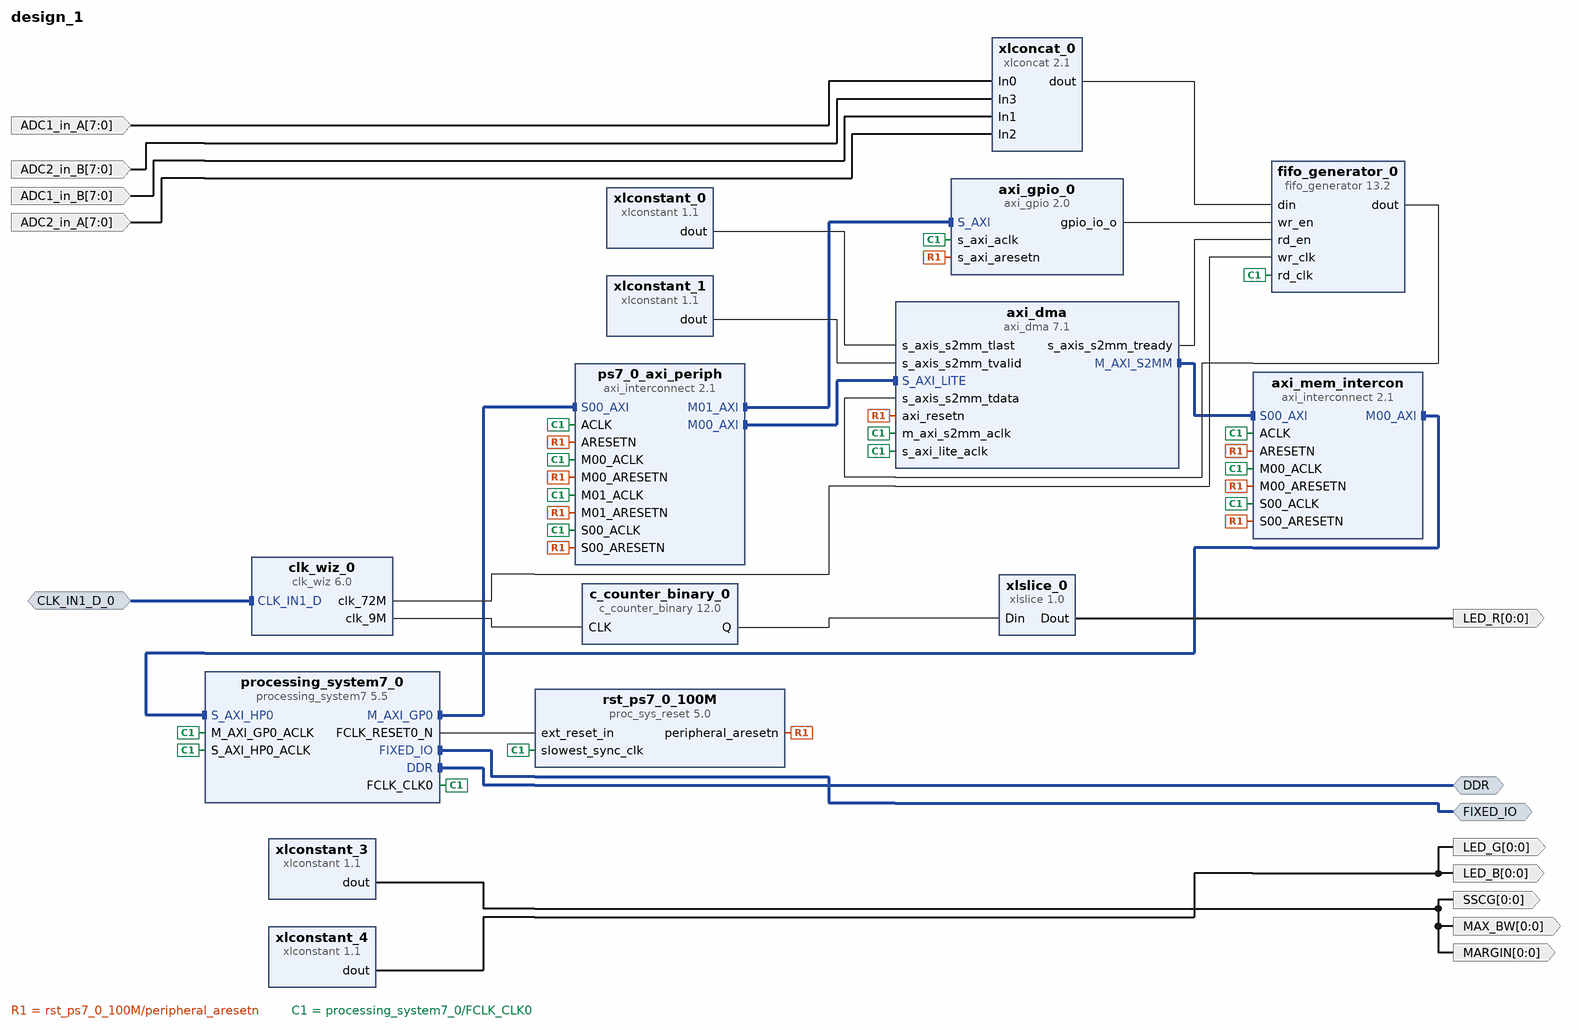
[diagram p0: block diagram of the top level]
# Vivado block design design_1, xc7z020clg400-1, Vivado 2020.1
create_bd_design design_1

create_bd_intf_port -mode Master -vlnv xilinx.com:interface:ddrx_rtl:1.0 DDR
create_bd_intf_port -mode Master -vlnv xilinx.com:display_processing_system7:fixedio_rtl:1.0 FIXED_IO
create_bd_intf_port -mode Slave -vlnv xilinx.com:interface:diff_clock_rtl:1.0 CLK_IN1_D_0
set_property -dict {CONFIG.FREQ_HZ 72000000} [get_bd_intf_ports CLK_IN1_D_0]
create_bd_port -dir I -from 7 -to 0 -type data ADC2_in_B
create_bd_port -dir I -from 7 -to 0 -type data ADC2_in_A
create_bd_port -dir I -from 7 -to 0 -type data ADC1_in_A
create_bd_port -dir I -from 7 -to 0 -type data ADC1_in_B
create_bd_port -dir O -from 0 -to 0 -type data LED_R
create_bd_port -dir O -from 0 -to 0 SSCG
create_bd_port -dir O -from 0 -to 0 MARGIN
create_bd_port -dir O -from 0 -to 0 MAX_BW
create_bd_port -dir O -from 0 -to 0 -type data LED_G
create_bd_port -dir O -from 0 -to 0 -type data LED_B

create_bd_cell -type ip -vlnv xilinx.com:ip:processing_system7:5.5 processing_system7_0
set_property -dict [list \
  CONFIG.PCW_APU_PERIPHERAL_FREQMHZ 666.666666 \
  CONFIG.PCW_CAN0_CAN0_IO {MIO 14 .. 15} \
  CONFIG.PCW_CAN0_PERIPHERAL_ENABLE 1 \
  CONFIG.PCW_ENET0_ENET0_IO {MIO 16 .. 27} \
  CONFIG.PCW_ENET0_GRP_MDIO_ENABLE 1 \
  CONFIG.PCW_ENET0_GRP_MDIO_IO {MIO 52 .. 53} \
  CONFIG.PCW_ENET0_PERIPHERAL_CLKSRC {ARM PLL} \
  CONFIG.PCW_ENET0_PERIPHERAL_ENABLE 1 \
  CONFIG.PCW_ENET_RESET_ENABLE 0 \
  CONFIG.PCW_FPGA0_PERIPHERAL_FREQMHZ 100 \
  CONFIG.PCW_FPGA1_PERIPHERAL_FREQMHZ 50 \
  CONFIG.PCW_GPIO_EMIO_GPIO_ENABLE 1 \
  CONFIG.PCW_GPIO_EMIO_GPIO_IO 1 \
  CONFIG.PCW_GPIO_EMIO_GPIO_WIDTH 1 \
  CONFIG.PCW_GPIO_MIO_GPIO_ENABLE 1 \
  CONFIG.PCW_GPIO_MIO_GPIO_IO MIO \
  CONFIG.PCW_GPIO_PERIPHERAL_ENABLE 1 \
  CONFIG.PCW_I2C0_I2C0_IO EMIO \
  CONFIG.PCW_I2C0_PERIPHERAL_ENABLE 1 \
  CONFIG.PCW_I2C1_I2C1_IO {MIO 12 .. 13} \
  CONFIG.PCW_I2C1_PERIPHERAL_ENABLE 1 \
  CONFIG.PCW_I2C_PERIPHERAL_FREQMHZ 83.333336 \
  CONFIG.PCW_I2C_RESET_ENABLE 0 \
  CONFIG.PCW_PRESET_BANK1_VOLTAGE {LVCMOS 1.8V} \
  CONFIG.PCW_QSPI_GRP_FBCLK_ENABLE 1 \
  CONFIG.PCW_QSPI_GRP_FBCLK_IO {MIO 8} \
  CONFIG.PCW_QSPI_GRP_SINGLE_SS_ENABLE 1 \
  CONFIG.PCW_QSPI_GRP_SINGLE_SS_IO {MIO 1 .. 6} \
  CONFIG.PCW_QSPI_PERIPHERAL_ENABLE 1 \
  CONFIG.PCW_QSPI_QSPI_IO {MIO 1 .. 6} \
  CONFIG.PCW_SD0_GRP_CD_ENABLE 1 \
  CONFIG.PCW_SD0_GRP_CD_IO {MIO 46} \
  CONFIG.PCW_SD0_GRP_WP_ENABLE 1 \
  CONFIG.PCW_SD0_GRP_WP_IO {MIO 47} \
  CONFIG.PCW_SD0_PERIPHERAL_ENABLE 1 \
  CONFIG.PCW_SD0_SD0_IO {MIO 40 .. 45} \
  CONFIG.PCW_SDIO_PERIPHERAL_FREQMHZ 100 \
  CONFIG.PCW_SINGLE_QSPI_DATA_MODE x4 \
  CONFIG.PCW_TTC0_PERIPHERAL_ENABLE 1 \
  CONFIG.PCW_TTC0_TTC0_IO EMIO \
  CONFIG.PCW_UART0_PERIPHERAL_ENABLE 1 \
  CONFIG.PCW_UART0_UART0_IO {MIO 10 .. 11} \
  CONFIG.PCW_UART1_PERIPHERAL_ENABLE 1 \
  CONFIG.PCW_UART1_UART1_IO {MIO 48 .. 49} \
  CONFIG.PCW_UART_PERIPHERAL_FREQMHZ 100 \
  CONFIG.PCW_UIPARAM_DDR_PARTNO {MT41J256M16 RE-125} \
  CONFIG.PCW_USB0_PERIPHERAL_ENABLE 1 \
  CONFIG.PCW_USB0_USB0_IO {MIO 28 .. 39} \
  CONFIG.PCW_USB_RESET_ENABLE 0 \
  CONFIG.PCW_USE_S_AXI_HP0 1 \
] [get_bd_cells processing_system7_0]
# 283 more settings of processing_system7_0 are not shown: defaults, MIO pin electricals, DDR timing, and values the tool derives
create_bd_cell -type ip -vlnv xilinx.com:ip:clk_wiz:6.0 clk_wiz_0
set_property -dict [list \
  CONFIG.CLKIN1_JITTER_PS 138.88 \
  CONFIG.CLKOUT1_JITTER 151.031 \
  CONFIG.CLKOUT1_PHASE_ERROR 102.228 \
  CONFIG.CLKOUT1_REQUESTED_OUT_FREQ 72 \
  CONFIG.CLKOUT2_JITTER 235.726 \
  CONFIG.CLKOUT2_PHASE_ERROR 102.228 \
  CONFIG.CLKOUT2_REQUESTED_OUT_FREQ 9 \
  CONFIG.CLKOUT2_USED true \
  CONFIG.CLKOUT3_JITTER 145.402 \
  CONFIG.CLKOUT3_PHASE_ERROR 118.291 \
  CONFIG.CLKOUT3_REQUESTED_OUT_FREQ 160 \
  CONFIG.CLKOUT3_REQUESTED_PHASE 180 \
  CONFIG.CLKOUT3_USED false \
  CONFIG.CLK_OUT1_PORT clk_72M \
  CONFIG.CLK_OUT2_PORT clk_9M \
  CONFIG.CLK_OUT3_PORT clk_160M \
  CONFIG.MMCM_CLKFBOUT_MULT_F 13.875 \
  CONFIG.MMCM_CLKIN1_PERIOD 13.889 \
  CONFIG.MMCM_CLKIN2_PERIOD 10.0 \
  CONFIG.MMCM_CLKOUT0_DIVIDE_F 13.875 \
  CONFIG.MMCM_CLKOUT1_DIVIDE 111 \
  CONFIG.MMCM_CLKOUT2_DIVIDE 1 \
  CONFIG.MMCM_CLKOUT2_PHASE 180.000 \
  CONFIG.MMCM_DIVCLK_DIVIDE 1 \
  CONFIG.NUM_OUT_CLKS 2 \
  CONFIG.PRIM_IN_FREQ 72 \
  CONFIG.PRIM_SOURCE Differential_clock_capable_pin \
  CONFIG.USE_LOCKED false \
  CONFIG.USE_RESET false \
] [get_bd_cells clk_wiz_0]
create_bd_cell -type ip -vlnv xilinx.com:ip:axi_dma:7.1 axi_dma
set_property -dict [list \
  CONFIG.c_include_mm2s 0 \
  CONFIG.c_include_s2mm_dre 0 \
  CONFIG.c_include_sg 0 \
  CONFIG.c_s2mm_burst_size 256 \
  CONFIG.c_s_axis_s2mm_tdata_width 32 \
] [get_bd_cells axi_dma]
create_bd_cell -type ip -vlnv xilinx.com:ip:axi_interconnect:2.1 axi_mem_intercon
set_property -dict {CONFIG.NUM_MI 1 CONFIG.NUM_SI 1} [get_bd_cells axi_mem_intercon]
create_bd_cell -type ip -vlnv xilinx.com:ip:proc_sys_reset:5.0 rst_ps7_0_100M
create_bd_cell -type ip -vlnv xilinx.com:ip:fifo_generator:13.2 fifo_generator_0
set_property -dict [list \
  CONFIG.Almost_Full_Flag false \
  CONFIG.Clock_Type_AXI Independent_Clock \
  CONFIG.FIFO_Implementation_axis Independent_Clocks_Block_RAM \
  CONFIG.FIFO_Implementation_rach Independent_Clocks_Distributed_RAM \
  CONFIG.FIFO_Implementation_rdch Independent_Clocks_Block_RAM \
  CONFIG.FIFO_Implementation_wach Independent_Clocks_Distributed_RAM \
  CONFIG.FIFO_Implementation_wdch Independent_Clocks_Block_RAM \
  CONFIG.FIFO_Implementation_wrch Independent_Clocks_Distributed_RAM \
  CONFIG.Fifo_Implementation Independent_Clocks_Block_RAM \
  CONFIG.INTERFACE_TYPE Native \
  CONFIG.Input_Data_Width 32 \
  CONFIG.Input_Depth 512 \
  CONFIG.Input_Depth_axis 2048 \
  CONFIG.Output_Data_Width 32 \
  CONFIG.Reset_Pin false \
  CONFIG.TDATA_NUM_BYTES 2 \
  CONFIG.synchronization_stages 2 \
] [get_bd_cells fifo_generator_0]
create_bd_cell -type ip -vlnv xilinx.com:ip:axi_interconnect:2.1 ps7_0_axi_periph
set_property -dict {CONFIG.NUM_MI 2} [get_bd_cells ps7_0_axi_periph]
create_bd_cell -type ip -vlnv xilinx.com:ip:xlconstant:1.1 xlconstant_0
set_property -dict {CONFIG.CONST_VAL 0} [get_bd_cells xlconstant_0]
create_bd_cell -type ip -vlnv xilinx.com:ip:xlconstant:1.1 xlconstant_1
create_bd_cell -type ip -vlnv xilinx.com:ip:c_counter_binary:12.0 c_counter_binary_0
set_property -dict {CONFIG.Output_Width 22 CONFIG.Sync_Threshold_Output false} [get_bd_cells c_counter_binary_0]
create_bd_cell -type ip -vlnv xilinx.com:ip:xlconcat:2.1 xlconcat_0
set_property -dict {CONFIG.NUM_PORTS 4} [get_bd_cells xlconcat_0]
create_bd_cell -type ip -vlnv xilinx.com:ip:xlconstant:1.1 xlconstant_3
set_property -dict {CONFIG.CONST_VAL 0} [get_bd_cells xlconstant_3]
create_bd_cell -type ip -vlnv xilinx.com:ip:xlconstant:1.1 xlconstant_4
create_bd_cell -type ip -vlnv xilinx.com:ip:xlslice:1.0 xlslice_0
set_property -dict {CONFIG.DIN_FROM 21 CONFIG.DIN_TO 21 CONFIG.DIN_WIDTH 22 CONFIG.DOUT_WIDTH 1} [get_bd_cells xlslice_0]
create_bd_cell -type ip -vlnv xilinx.com:ip:axi_gpio:2.0 axi_gpio_0
set_property -dict {CONFIG.C_GPIO_WIDTH 1} [get_bd_cells axi_gpio_0]

# ---- connections ----

connect_bd_intf_net [get_bd_intf_pins axi_mem_intercon/M00_AXI] [get_bd_intf_pins processing_system7_0/S_AXI_HP0]
connect_bd_intf_net [get_bd_intf_pins ps7_0_axi_periph/M00_AXI] [get_bd_intf_pins axi_dma/S_AXI_LITE]
connect_bd_intf_net [get_bd_intf_pins axi_dma/M_AXI_S2MM] [get_bd_intf_pins axi_mem_intercon/S00_AXI]
connect_bd_intf_net [get_bd_intf_pins processing_system7_0/M_AXI_GP0] [get_bd_intf_pins ps7_0_axi_periph/S00_AXI]
connect_bd_intf_net -intf_net CLK_IN1_D_0_1 [get_bd_intf_ports CLK_IN1_D_0] [get_bd_intf_pins clk_wiz_0/CLK_IN1_D]
connect_bd_intf_net [get_bd_intf_ports FIXED_IO] [get_bd_intf_pins processing_system7_0/FIXED_IO]
connect_bd_intf_net [get_bd_intf_ports DDR] [get_bd_intf_pins processing_system7_0/DDR]
connect_bd_intf_net [get_bd_intf_pins ps7_0_axi_periph/M01_AXI] [get_bd_intf_pins axi_gpio_0/S_AXI]
connect_bd_net [get_bd_pins processing_system7_0/FCLK_RESET0_N] [get_bd_pins rst_ps7_0_100M/ext_reset_in]
connect_bd_net [get_bd_pins rst_ps7_0_100M/peripheral_aresetn] \
  [get_bd_pins axi_mem_intercon/M00_ARESETN] [get_bd_pins axi_mem_intercon/S00_ARESETN] \
  [get_bd_pins axi_mem_intercon/ARESETN] [get_bd_pins ps7_0_axi_periph/S00_ARESETN] [get_bd_pins axi_dma/axi_resetn] \
  [get_bd_pins ps7_0_axi_periph/M00_ARESETN] [get_bd_pins ps7_0_axi_periph/ARESETN] [get_bd_pins axi_gpio_0/s_axi_aresetn] \
  [get_bd_pins ps7_0_axi_periph/M01_ARESETN]
connect_bd_net [get_bd_pins processing_system7_0/FCLK_CLK0] \
  [get_bd_pins axi_dma/m_axi_s2mm_aclk] [get_bd_pins axi_mem_intercon/S00_ACLK] \
  [get_bd_pins processing_system7_0/M_AXI_GP0_ACLK] [get_bd_pins ps7_0_axi_periph/S00_ACLK] \
  [get_bd_pins rst_ps7_0_100M/slowest_sync_clk] [get_bd_pins axi_dma/s_axi_lite_aclk] [get_bd_pins ps7_0_axi_periph/M00_ACLK] \
  [get_bd_pins ps7_0_axi_periph/ACLK] [get_bd_pins axi_mem_intercon/ACLK] [get_bd_pins axi_mem_intercon/M00_ACLK] \
  [get_bd_pins processing_system7_0/S_AXI_HP0_ACLK] [get_bd_pins fifo_generator_0/rd_clk] [get_bd_pins axi_gpio_0/s_axi_aclk] \
  [get_bd_pins ps7_0_axi_periph/M01_ACLK]
connect_bd_net [get_bd_pins xlconstant_0/dout] [get_bd_pins axi_dma/s_axis_s2mm_tlast]
connect_bd_net [get_bd_pins fifo_generator_0/dout] [get_bd_pins axi_dma/s_axis_s2mm_tdata]
connect_bd_net [get_bd_pins axi_dma/s_axis_s2mm_tready] [get_bd_pins fifo_generator_0/rd_en]
connect_bd_net [get_bd_pins xlconstant_1/dout] [get_bd_pins axi_dma/s_axis_s2mm_tvalid]
connect_bd_net -net ADC_handler_0_data_out_IQ [get_bd_pins xlconcat_0/dout] [get_bd_pins fifo_generator_0/din]
connect_bd_net [get_bd_pins clk_wiz_0/clk_9M] [get_bd_pins c_counter_binary_0/CLK]
connect_bd_net [get_bd_pins clk_wiz_0/clk_72M] [get_bd_pins fifo_generator_0/wr_clk]
connect_bd_net [get_bd_ports ADC1_in_A] [get_bd_pins xlconcat_0/In0]
connect_bd_net [get_bd_ports ADC2_in_B] [get_bd_pins xlconcat_0/In3]
connect_bd_net [get_bd_ports ADC1_in_B] [get_bd_pins xlconcat_0/In1]
connect_bd_net [get_bd_ports ADC2_in_A] [get_bd_pins xlconcat_0/In2]
connect_bd_net [get_bd_pins xlconstant_3/dout] [get_bd_ports MARGIN] [get_bd_ports MAX_BW] [get_bd_ports SSCG]
connect_bd_net [get_bd_pins xlconstant_4/dout] [get_bd_ports LED_B] [get_bd_ports LED_G]
connect_bd_net [get_bd_pins c_counter_binary_0/Q] [get_bd_pins xlslice_0/Din]
connect_bd_net [get_bd_pins xlslice_0/Dout] [get_bd_ports LED_R]
connect_bd_net [get_bd_pins axi_gpio_0/gpio_io_o] [get_bd_pins fifo_generator_0/wr_en]

# ---- address map ----
assign_bd_address -offset 0x00000000 -range 1G -target_address_space [get_bd_addr_spaces axi_dma/Data_S2MM] [get_bd_addr_segs processing_system7_0/S_AXI_HP0/HP0_DDR_LOWOCM]
assign_bd_address -offset 0x40400000 -range 64K -target_address_space [get_bd_addr_spaces processing_system7_0/Data] [get_bd_addr_segs axi_dma/S_AXI_LITE/Reg]
assign_bd_address -offset 0x41200000 -range 64K -target_address_space [get_bd_addr_spaces processing_system7_0/Data] [get_bd_addr_segs axi_gpio_0/S_AXI/Reg]

validate_bd_design
save_bd_design
